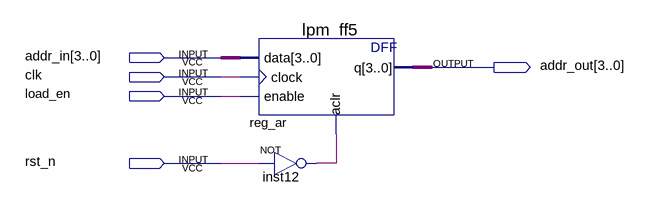
[diagram p0: schematic sheet]
// Quartus schematic ar_unit.bdf as structural Verilog: 2 symbols, 5 pins
module ar_unit (
  input  [3:0] addr_in,
  input  clk,
  input  load_en,
  input  rst_n,
  output [3:0] addr_out
);

  wire inst12_out;

  lpm_ff5 reg_ar (.data(addr_in), .clock(clk), .enable(load_en), .aclr(inst12_out), .q(addr_out));
  not inst12 (inst12_out, rst_n);
endmodule
